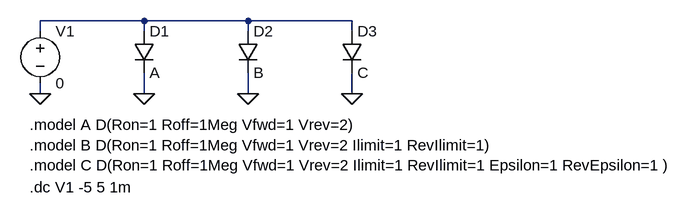
[diagram p0: schematic IdealDiodeExample.asc]
IdealDiodeExample.asc, the LTspice schematic file:
Version 4
SHEET 1 1376 680
WIRE 160 80 0 80
WIRE 320 80 160 80
WIRE 480 80 320 80
WIRE 0 96 0 80
WIRE 160 96 160 80
WIRE 320 96 320 80
WIRE 480 96 480 80
WIRE 0 192 0 176
WIRE 160 192 160 160
WIRE 320 192 320 160
WIRE 480 192 480 160
FLAG 160 192 0
FLAG 0 192 0
FLAG 320 192 0
FLAG 480 192 0
SYMBOL diode 144 96 R0
SYMATTR InstName D1
SYMATTR Value A
SYMBOL voltage 0 80 R0
SYMATTR InstName V1
SYMATTR Value 0
SYMBOL diode 304 96 R0
SYMATTR InstName D2
SYMATTR Value B
SYMBOL diode 464 96 R0
SYMATTR InstName D3
SYMATTR Value C
TEXT -16 336 Left 2 !.dc V1 -5 5 1m
TEXT -16 240 Left 2 !.model A D(Ron=1 Roff=1Meg Vfwd=1 Vrev=2)\n.model B D(Ron=1 Roff=1Meg Vfwd=1 Vrev=2 Ilimit=1 RevIlimit=1)\n.model C D(Ron=1 Roff=1Meg Vfwd=1 Vrev=2 Ilimit=1 RevIlimit=1 Epsilon=1 RevEpsilon=1 )

The netlist it stands for:
* IdealDiodeExample.asc
D1 N001 0 A
V1 N001 0 0
D2 N001 0 B
D3 N001 0 C
.model D D
.lib standard.dio
.dc V1 -5 5 1m
.model A D(Ron=1 Roff=1Meg Vfwd=1 Vrev=2)
.model B D(Ron=1 Roff=1Meg Vfwd=1 Vrev=2 Ilimit=1 RevIlimit=1)
.model C D(Ron=1 Roff=1Meg Vfwd=1 Vrev=2 Ilimit=1 RevIlimit=1 Epsilon=1 RevEpsilon=1 )
.backanno
.end